# EAGLE design lizard-ttl-dLatch (EAGLE 6.3)
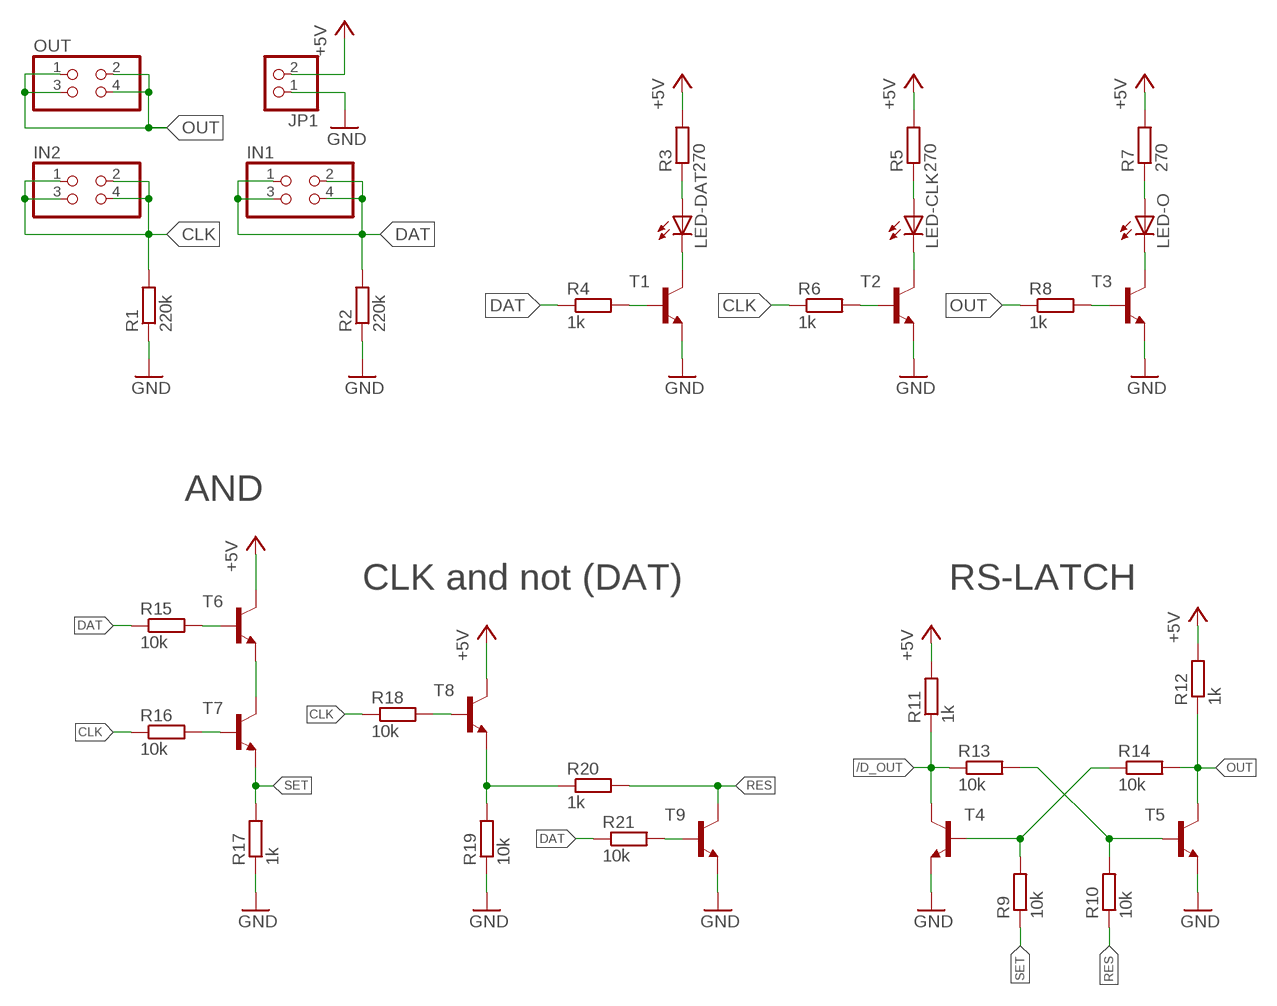
[diagram p0: schematic, sheet 1]

## Parts
IN1  PINHD-2X2/EDGE  [2X02/EDGE]
IN2  PINHD-2X2/EDGE  [2X02/EDGE]
JP1  PINHD-1X2  [1X02]
LED-CLK  LEDCHIPLED_0603  [CHIPLED_0603]
LED-DAT  LEDCHIPLED_0603  [CHIPLED_0603]
LED-O  LEDCHIPLED_0603  [CHIPLED_0603]
OUT  PINHD-2X2/EDGE  [2X02/EDGE]
R1  220k  R-EU_R0603  [R0603]
R2  220k  R-EU_R0603  [R0603]
R3  270  R-EU_R0603  [R0603]
R4  1k  R-EU_R0603  [R0603]
R5  270  R-EU_R0603  [R0603]
R6  1k  R-EU_R0603  [R0603]
R7  270  R-EU_R0603  [R0603]
R8  1k  R-EU_R0603  [R0603]
R9  10k  R-EU_R0603  [R0603]
R10  10k  R-EU_R0603  [R0603]
R11  1k  R-EU_R0603  [R0603]
R12  1k  R-EU_R0603  [R0603]
R13  10k  R-EU_R0603  [R0603]
R14  10k  R-EU_R0603  [R0603]
R15  10k  R-EU_R0603  [R0603]
R16  10k  R-EU_R0603  [R0603]
R17  1k  R-EU_R0603  [R0603]
R18  10k  R-EU_R0603  [R0603]
R19  10k  R-EU_R0603  [R0603]
R20  1k  R-EU_R0603  [R0603]
R21  10k  R-EU_R0603  [R0603]
T1  BC817-40-NPN-SOT23-BEC  [SOT23-BEC]
T2  BC817-40-NPN-SOT23-BEC  [SOT23-BEC]
T3  BC817-40-NPN-SOT23-BEC  [SOT23-BEC]
T4  BC817-40-NPN-SOT23-BEC  [SOT23-BEC]
T5  BC817-40-NPN-SOT23-BEC  [SOT23-BEC]
T6  BC817-40-NPN-SOT23-BEC  [SOT23-BEC]
T7  BC817-40-NPN-SOT23-BEC  [SOT23-BEC]
T8  BC817-40-NPN-SOT23-BEC  [SOT23-BEC]
T9  BC817-40-NPN-SOT23-BEC  [SOT23-BEC]

## Nets
+5V: JP1.2 R3.2 R5.2 R7.2 R11.2 R12.2 T6.C T8.C
/D_OUT: R11.1 R13.1 T4.C
CLK: IN2.1 IN2.2 IN2.3 IN2.4 R1.2 R6.1 R16.1 R18.1
DAT: IN1.1 IN1.2 IN1.3 IN1.4 R2.2 R4.1 R15.1 R21.1
GND: JP1.1 R1.1 R2.1 R17.1 R19.1 T1.E T2.E T3.E T4.E T5.E T9.E
N$1: T6.E T7.C
N$2: R21.2 T9.B
N$4: R4.2 T1.B
N$5: LED-DAT.A R3.1
N$6: LED-DAT.C T1.C
N$7: R6.2 T2.B
N$8: LED-CLK.A R5.1
N$9: LED-CLK.C T2.C
N$10: R8.2 T3.B
N$11: LED-O.A R7.1
N$12: LED-O.C T3.C
N$14: R15.2 T6.B
N$15: R16.2 T7.B
N$16: R9.2 R14.1 T4.B
N$17: R10.2 R13.2 T5.B
N$19: R19.2 R20.1 T8.E
N$23: R18.2 T8.B
OUT: OUT.1 OUT.2 OUT.3 OUT.4 R8.1 R12.1 R14.2 T5.C
RES: R10.1 R20.2 T9.C
SET: R9.1 R17.2 T7.E

## Notes on the sheet
- AND
- CLK and not (DAT) | RS-LATCH

## Library data of the parts
IN1 IN2 OUT = pinhead-mod:PINHD-2X2: PIN HEADER
JP1 = pinhead-mod:PINHD-1X2: PIN HEADER
LED-CLK LED-DAT LED-O = led:LED: LED OSRAM: - CHIPLED LG R971, LG N971, LY N971, LG Q971, LY Q971, LO R971, LY R971 LH N974, LH R974 LS Q976, LO Q976, LY Q976 LO Q996 - Hyper CHIPLED LW Q18S LB Q993, LB Q99A, LB R99A - SideLED LS A670, LO A670, LY A670, LG A670, LP A670 LB A673, LV A673, LT A673, LW A673 LH A674 LY A675 LS A676, LA A676, LO A676, LY A676, LW A676 LS A679, LY A679, LG A679 - Hyper Micro SIDELED® LS Y876, LA Y876, LO Y876, LY Y876 LT Y87S - SmartLED LW L88C, LW L88S LB L89C, LB L89S, LG L890 LS L89K, LO L89K, LY L89K LS L896, LA L896, LO L896, LY L896 - TOPLED LS T670, LO T670, LY T670, LG T670, LP T670 LSG T670, LSP T670, LSY T670, LOP T670, LYG T670 LG T671, LOG T671, LSG T671 LB T673, LV T673, LT T673, LW T673 LH T674 LS T676, LA T676, LO T676, LY T676, LB T676, LH T676, LSB T676, LW T676 LB T67C, LV T67C, LT T67C, LS T67K, LO T67K, LY T67K, LW E67C LS E67B, LA E67B, LO E67B, LY E67B, LB E67C, LV E67C, LT E67C LW T67C LS T679, LY T679, LG T679 LS T770, LO T770, LY T770, LG T770, LP T770 LB T773, LV T773, LT T773, LW T773 LH T774 LS E675, LA E675, LY E675, LS T675 LS T776, LA T776, LO T776, LY T776, LB T776 LHGB T686 LT T68C, LB T68C - Hyper Mini TOPLED® LB M676 - Mini TOPLED Santana® LG M470 LS M47K, LO M47K, LY M47K Source: http://www.osram.convergy.de LUXEON: - LUMILED® LXK2-PW12-R00, LXK2-PW12-S00, LXK2-PW14-U00, LXK2-PW14-V00 LXK2-PM12-R00, LXK2-PM12-S00, LXK2-PM14-U00 LXK2-PE12-Q00, LXK2-PE12-R00, LXK2-PE12-S00, LXK2-PE14-T00, LXK2-PE14-U00 LXK2-PB12-K00, LXK2-PB12-L00, LXK2-PB12-M00, LXK2-PB14-N00, LXK2-PB14-P00, LXK2-PB14-Q00 LXK2-PR12-L00, LXK2-PR12-M00, LXK2-PR14-Q00, LXK2-PR14-R00 LXK2-PD12-Q00, LXK2-PD12-R00, LXK2-PD12-S00 LXK2-PH12-R00, LXK2-PH12-S00 LXK2-PL12-P00, LXK2-PL12-Q00, LXK2-PL12-R00 Source: www.luxeon.com KINGBRIGHT: KA-3528ASYC Source: www.kingbright.com
R1-R21 = p.peter-rcl:R-EU_: RESISTOR, European symbol
T1-T9 = transistor:*-NPN-: NPN Transistror BF959 corrected 2008.03.06

## Board
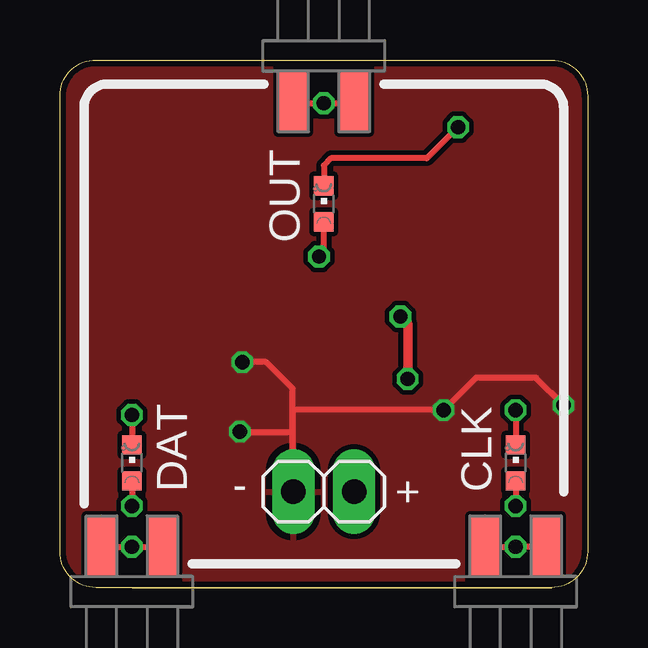
[diagram p1: board, top side]
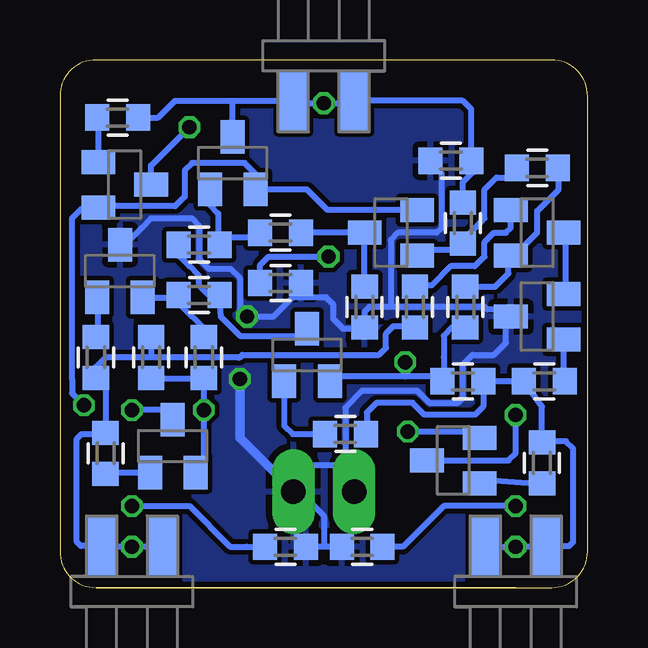
[diagram p2: board, bottom side, seen from below]

Size 22 x 22 mm. Coordinates in mm from the lower left corner, seen from the top.
Outline: 3,0 20.5,0
Outline: 3,0 1.5,0 arc-90 0,1.5 0,20.5 arc-90 1.5,22 20.5,22 arc-90 22,20.5 22,1.5 arc-90 20.5,0
Outline: 20.5,0 3,0
Copper layers (1*16): Top 0.035mm / dielectric 1.5mm / Bottom 0.035mm
Design rules "Fusion_eagle_rule_v1.1 *": minimum track width 6mil, minimum drill 12mil, track to track 6mil, track to pad 6mil, pad to pad 6mil, via to via 6mil, smd to smd 0mil, copper to edge 10mil, drill to drill 10mil, minimum pad ring 15mil, minimum via ring 6mil, stop-mask expansion 2mil, vias tented up to drill 100mil, thermal gap 10mil

### Footprints (pad centres in the part's own frame; a part is rotated, then mirrored left to right if it is on the bottom)
2X02/EDGE = smd 1.27 x 2.54: 1 1.27,1.73; 3 -1.27,1.73 | smd 1.27 x 2.54 bottom: 2 1.27,1.73; 4 -1.27,1.73
1X02 = drill 1.016 long: 1 -1.27,0; 2 1.27,0
CHIPLED_0603 = smd 0.8 x 0.8: A 0,-0.75; C 0,0.75
R0603 = smd 1 x 1.1: 1 -0.85,0; 2 0.85,0
SOT23-BEC = smd 1 x 1.4: B -0.95,-1.1; C 0,1.1; E 0.95,-1.1

### Placement (x,y rotation side)
IN1  3,0 0 top
IN2  19,0 0 top
JP1  11,4 0 top
LED-CLK  19,5.2 0 top
LED-DAT  3,5.2 0 top
LED-O  11,16 0 top
OUT  11,22 180 top
R1  18.2,9.6 90 bottom
R2  5.2,8.6 0 bottom
R3  9.4,1.7 180 bottom
R4  1.9,5.2 270 bottom
R5  12.6,1.7 0 bottom
R6  20.1,5.6 270 bottom
R7  12.8,12.7 0 bottom
R8  19.6,19.6 180 bottom
R9  2.1,17.5 180 bottom
R10  16.2,14.3 0 bottom
R11  9.3,11.7 270 bottom
R12  5.7,17.8 180 bottom
R13  12.8,14.8 180 bottom
R14  5.2,15.2 90 bottom
R15  1.8,8.6 0 bottom
R16  7.2,11.7 90 bottom
R17  5.1,11.7 90 bottom
R18  20.5,9.6 90 bottom
R19  16,9.6 90 bottom
R20  16.2,12.2 0 bottom
R21  10.1,6.4 180 bottom
T1  5.6,5.3 90 bottom
T2  17.3,5.9 0 bottom
T3  19.3,16.8 270 bottom
T4  8.2,14.8 90 bottom
T5  14.8,17.7 0 bottom
T6  2.1,11.3 90 bottom
T7  2.1,14.8 270 bottom
T8  19.5,13.2 0 bottom
T9  11.7,9.7 0 bottom
U$1  [LOGO-JUSTGEEK-XS-MASK]  4,18 0 top

### Tracks (layer width: path | path; a pad name or v marks a point on that pad's centre or on a via)
+5V  (via drill 0.6 pad 0.4)
  Top 0.4: v14.5,8.7 14.5,8.8 14.5,11 v14.2,11.3
  Bottom 0.25: R3.2 11,1.7 | 11,1.7 R5.2 | 12,4 11,3 11,1.7 | T6.C 3.3,11.3 3.45,11.45 | 3.45,11.45 3.6,11.6 3.7,11.6 4.2,11.6 4.3,11.7 7.8,11.7 8.2,11.7 | 19.5,14.4 T8.C | 3.45,11.45 3.4,11.4 3.4,10.2 3.9,9.7 4.8,9.7 5.2,9.3 5.2,7.9 5.4,7.7 6.6,7.7 7,8.1 7.1,8.2 9.4,8.2 10.1,7.5 10.1,6 10.1,5.5 10.5,5.1 12,5.1 12.2,4.9 12.2,4.07 JP1.2 | 19.2,13.7 T8.C | 8.2,11.7 9.1,11.7 9.3,11.5 R11.2 9.35,10.8 10.2,10.8 10.6,11.2 10.6,11.8 10.7,11.9 10.8,12 10.9,12.1 11.9,12.1 | R12.2 6.3,17.8 6.2,17.7 6.2,17.4 6.1,17.3 6.1,15 6.3,14.8 7.9,14.8 8.2,14.5 8.2,11.8 8.2,11.7 | R7.2 12.1,12.7 11.9,12.7 11.9,12.1 | 11.9,12.1 12.3,12.1 13.1,11.3 v14.2,11.3 14.5,11.6 14.5,12.9 14.9,13.3 15.8,13.3 16.2,13.7 16.2,15.1 16.5,15.4 18.2,15.4 18.6,15 19,14.6 19.2,14.4 19.4,14.4 T8.C
  Bottom 0.4: 12,4 JP1.2 12.5,4.23 14.5,6.23 v14.5,8.7
  pour Bottom (isolate 0.2): 0,0 0,22 22,22 22,0
/D_OUT
  Bottom 0.25: R11.1 T4.C R13.1
CLK  (via drill 0.6 pad 0.4)
  Top 0.25: IN2.4 17.97,1.73 18,1.7 18.9,1.7 v19,1.7 19.4,1.7 20.24,1.7 | 19.8,1.7 19.7,1.7 19.73,1.73 IN2.2 | 19.8,1.7 20.24,1.7 | 20.24,1.7 IN2.2 | IN2.2 19.83,1.73 | 19.83,1.73 19.8,1.7 | IN2.2 19.83,1.73 | 19.83,1.73 19.8,1.7
  Bottom 0.25: IN2.4 18.07,1.73 18.1,1.7 v19,1.7 20.24,1.7 IN2.2 21.13,1.73 21.3,1.9 21.3,6.2 21.1,6.4 20.15,6.4 R6.1 20.1,8.7 20.15,8.75 R18.1 | 20.25,8.75 R18.1 | R16.1 7.2,10.9 | 7.65,10.85 R16.1 | R16.1 7.25,10.9 8.1,10.9 8.4,10.6 8.4,10 8.7,9.7 14.4,9.7 14.5,9.6 14.6,9.6 14.9,9.6 18,9.6 18.2,9.6 | 18.2,9.6 20.1,9.6 20.5,9.2 R18.1 | R1.2 18.2,9.6
DAT  (via drill 0.6 pad 0.4)
  Top 0.25: IN1.4 2.07,1.73 2.1,1.7 v3,1.7 4.24,1.7 IN1.2
  Bottom 0.25: IN1.2 4.03,1.73 4,1.7 v3,1.7 2.4,1.7 2.37,1.73 IN1.4 0.77,1.73 0.6,1.9 0.6,5.8 0.9,6.1 1.85,6.1 R4.1 1.9,7.55 R15.1 R2.2 4.35,7.55 4.7,7.2 6.8,7.2 7.3,7.7 8.8,7.7 9.2,7.3 9.2,6.45 R21.1
GND  (via drill 0.6 pad 0.4)
  Top 0.25: 9.7,4.03 JP1.1 9.73,4.27 9.7,4.3 9.7,5 9.7,5.7 | 9.7,7.4 v16,7.4 17.35,8.75 R1.1 19.85,8.75 v21,7.6 | 9.7,7.4 9.7,6.5 | 9.7,6.5 9.7,5.7 | v7.5,6.5 9.7,6.5 | 9.7,5.7 9.7,6.5 | 9.7,6.5 9.7,7.4 | 9.7,7.4 9.7,8.3 8.6,9.4 v7.6,9.4
  Bottom 0.25: 16,8.7 v16,7.4 16,5.1 16.1,5 16.1,4.9 16.2,4.8 T2.E | 16,8.7 R19.1 16,8.7 | 16,8.7 18.15,8.7 R1.1 | R17.1 5.65,10.85 6,10.5 6,9.6 6,8.65 R2.1 6.05,8.75 6.1,8.8 7.6,8.8 | T1.E 4.65,6.25 4.7,6.3 4.8,6.3 5,6.5 v7.5,6.5 | v21,7.6 21.5,8.1 21.5,8.7 21.5,14.9 21.5,15.4 21.1,15.8 20.45,15.8 T3.E | 10.7,8.6 T9.E 10.55,8.8 7.6,8.8 | 19.9,15.9 20.35,15.9 | 20.35,15.9 T3.E | 20.35,15.9 17.2,15.9 16.8,16.3 16.8,17.4 16.5,17.7 14.3,17.7 13.85,17.25 T5.E 11.7,16.6 10.85,15.75 T4.E 7.75,15.75 7.85,15.75 | 20.35,15.9 T3.E | v7.6,9.4 7.6,8.8
  pour Top (isolate 0.2): 0,0 0,22 22,22 22,0
N$1
  Bottom 0.25: T6.E 0.95,12.25 0.9,12.2 0.9,14.7 T7.C
N$2
  Bottom 0.25: T9.B 12.65,6.75 12.3,6.4 R21.2
N$4
  Bottom 0.25: R4.2 1.9,4.3 4.45,4.5 T1.B
N$5  (via drill 0.6 pad 0.4)
  Top 0.25: LED-DAT.A v3,3.4
  Bottom 0.25: v3,3.4 6,3.4 6.6,2.8 7.7,1.7 R3.1
N$6  (via drill 0.6 pad 0.4)
  Top 0.25: v3,7.2 3,6.15 LED-DAT.C
  Bottom 0.25: T1.C 3.3,5.3 3,5.6 v3,7.2
N$7
  Bottom 0.25: R6.2 20.1,4.8 T2.B
N$8  (via drill 0.6 pad 0.4)
  Top 0.25: LED-CLK.A v19,3.4
  Bottom 0.25: R5.1 14.2,1.7 14.9,1.7 16.6,3.4 v19,3.4
N$9  (via drill 0.6 pad 0.4)
  Top 0.25: v19,7.4 LED-CLK.C
  Bottom 0.25: T2.C 17.3,7.3 17.4,7.4 v19,7.4
N$10
  Bottom 0.25: R8.2 20.4,19.6 T3.B
N$11  (via drill 0.6 pad 0.4)
  Top 0.25: v10.8,13.8 11,14 11,14.95 LED-O.A
  Bottom 0.25: R7.1 13.65,13.45 13.3,13.8 v10.8,13.8
N$12  (via drill 0.6 pad 0.4)
  Top 0.25: v16.6,19.2 15.3,17.9 11.3,17.9 11,17.6 LED-O.C
  Bottom 0.25: T3.C 18.2,17.6 v16.6,19.2
N$14
  Bottom 0.25: R15.2 0.95,8.65 1,8.7 T6.B
N$15
  Bottom 0.25: 3.3,15.7 3.25,15.75 T7.B 3.2,15 3.4,14.8 3.9,14.8 4.3,14.4 4.3,13.8 4.7,13.4 5.7,13.4 6.5,12.6 7.15,12.6 R16.2 7.1,12.75
N$16
  Bottom 0.25: 3,17.3 2.95,17.35 R9.2 3.35,17.1 3.8,17.1 4.3,16.6 4.3,15.4 4.4,15.3 4.5,15.2 5.2,14.5 R14.1 5.45,14.1 7.1,14.1 T4.B
N$17
  Bottom 0.25: 13.6,14.8 R13.2 13.75,14.65 13.8,14.6 14.95,14.6 R10.2 15.4,14.45 15.4,15.2 15.4,15.6 15.75,15.95 T5.B
N$19
  Bottom 0.25: T8.E 18.5,12.1 17.05,12.1 R20.1 16.95,11.75 16,10.8 R19.2
N$23
  Bottom 0.25: R18.2 20.45,10.45 20.4,10.4 20.4,12.05 T8.B
OUT  (via drill 0.6 pad 0.4)
  Top 0.25: OUT.2 10.03,20.27 10,20.2 v11,20.2 12,20.2 12.2,20.3 | 12.2,20.3 OUT.4 12.17,20.17 12.2,20.3
  Bottom 0.25: OUT.4 12.17,20.17 12.1,20.2 v11,20.2 9.7,20.2 9.8,21.2 OUT.2 9.7,20.3 5.2,20.3 4.85,19.95 R12.1 4.8,17.75 4.8,17.3 5.2,16.9 R14.2 | 12.34,21.2 OUT.4 | 13.7,20.3 13,20.3 | 13,20.3 12.3,20.3 OUT.4 | R8.1 17.9,19.6 17.2,20.3 14.8,20.3 | 14.8,20.3 14.3,20.3 13,20.3 | T5.C 14.8,20.3
RES
  Bottom 0.25: 15.3,12.25 R20.2 | 15.25,12.55 R20.2 | R20.2 15.3,12.15 15.3,11.4 15.3,11.3 14.5,10.5 12,10.5 T9.C | 17,14.2 17,14.3 R10.1 17,14.25 17,13.8 16.6,13.4 16.2,13 16.2,12.6 15.8,12.2 R20.2
SET
  Bottom 0.25: R17.2 3.85,12.55 3.3,13.1 3.3,13.75 T7.E 3.05,13.85 2.1,14.8 2.1,15.7 1.2,16.6 1.2,17.45 R9.1

### Text on the board
tPlace: OUT | DAT | - | + | CLK
tStop: 1-Bit latch | v0.3 | justgeek.de